# Altium schematic sheet OUT_RELE.SchDoc
size A4; SheetNumber: 4
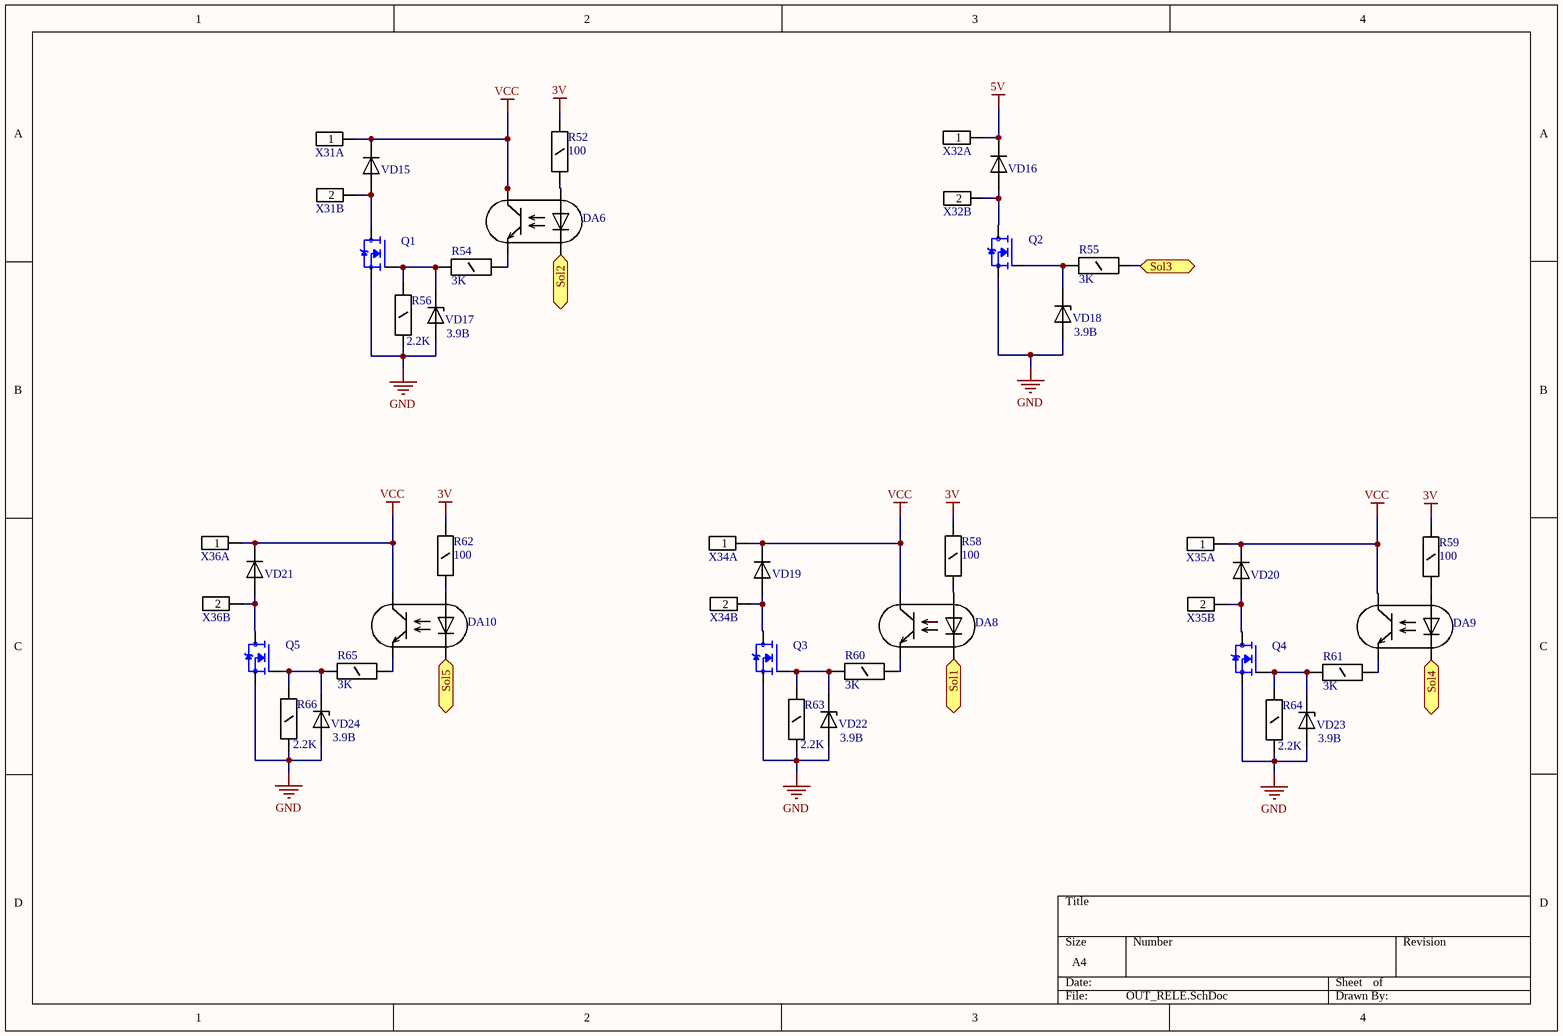
[diagram p0: OUT_RELE.SchDoc]

## Parts
DA6  PC817  [SOIC254P1000X400-4N]  (value not drawn)
DA8  PC817  [SOIC254P1000X400-4N]  (value not drawn)
DA9  PC817  [SOIC254P1000X400-4N]  (value not drawn)
DA10  PC817  [SOIC254P1000X400-4N]  (value not drawn)
Q1  IRFZ44N  [DPAK254P1524X483-3N]  (value not drawn)
Q2  IRFZ44N  [DPAK254P1524X483-3N]  (value not drawn)
Q3  IRFZ44N  [DPAK254P1524X483-3N]  (value not drawn)
Q4  IRFZ44N  [DPAK254P1524X483-3N]  (value not drawn)
Q5  IRFZ44N  [DPAK254P1524X483-3N]  (value not drawn)
R52  100  [R_1206]
R54  3K  [R_1206]
R55  3K  [R_1206]
R56  2.2K  [R_1206]
R58  100  [R_1206]
R59  100  [R_1206]
R60  3K  [R_1206]
R61  3K  [R_1206]
R62  100  [R_1206]
R63  2.2K  [R_1206]
R64  2.2K  [R_1206]
R65  3K  [R_1206]
R66  2.2K  [R_1206]
VD15  SMA4007  [SMA (DO-214AC)]  (value not drawn)
VD16  SMA4007  [SMA (DO-214AC)]  (value not drawn)
VD17  3.9В  [DL-35]
VD18  3.9В  [DL-35]
VD19  SMA4007  [SMA (DO-214AC)]  (value not drawn)
VD20  SMA4007  [SMA (DO-214AC)]  (value not drawn)
VD21  SMA4007  [SMA (DO-214AC)]  (value not drawn)
VD22  3.9В  [DL-35]
VD23  3.9В  [DL-35]
VD24  3.9В  [DL-35]
X31  DG508V-02  [DG508V-02]  (value not drawn)  (parts A,B of 2)
X32  DG508V-02  [DG508V-02]  (value not drawn)  (parts A,B of 2)
X34  DG508V-02  [DG508V-02]  (value not drawn)  (parts A,B of 2)
X35  DG508V-02  [DG508V-02]  (value not drawn)  (parts A,B of 2)
X36  DG508V-02  [DG508V-02]  (value not drawn)  (parts A,B of 2)

## Ports
Sol1, Sol2, Sol3, Sol4, Sol5

## Nets
3V: R52.1 R58.1 R59.1 R62.1
5V: VD16.K X32.1
GND: Q1.3(S) Q2.3(S) Q3.3(S) Q4.3(S) Q5.3(S) R56.1 R63.1 R64.1 R66.1 VD17.1 VD18.1 VD22.1 VD23.1 VD24.1
VCC: DA6.4 DA8.4 DA9.4 DA10.4 VD15.K VD19.K VD20.K VD21.K X31.1 X34.1 X35.1 X36.1
Sol1: DA8.2 ; port Sol1
Sol2: DA6.2 ; port Sol2
Sol3: R55.2 ; port Sol3
Sol4: DA9.2 ; port Sol4
Sol5: DA10.2 ; port Sol5
NetDA6_1: DA6.1 R52.2
NetDA6_3: DA6.3 R54.2
NetDA8_1: DA8.1 R58.2
NetDA8_3: DA8.3 R60.2
NetDA9_1: DA9.1 R59.2
NetDA9_3: DA9.3 R61.2
NetDA10_1: DA10.1 R62.2
NetDA10_3: DA10.3 R65.2
NetQ1_1: Q1.1(G) R54.1 R56.2 VD17.2
NetQ1_2: Q1.2(D) VD15.A X31.2
NetQ2_1: Q2.1(G) R55.1 VD18.2
NetQ2_2: Q2.2(D) VD16.A X32.2
NetQ3_1: Q3.1(G) R60.1 R63.2 VD22.2
NetQ3_2: Q3.2(D) VD19.A X34.2
NetQ4_1: Q4.1(G) R61.1 R64.2 VD23.2
NetQ4_2: Q4.2(D) VD20.A X35.2
NetQ5_1: Q5.1(G) R65.1 R66.2 VD24.2
NetQ5_2: Q5.2(D) VD21.A X36.2

## Library data of the parts
DA6 DA8-DA10 = KPC357NT: оптрон, SMD; Name: PC817; Mounting: SMD
Q1-Q5 = IRFZ44NSTRRPBF: N-Channel 55V 49A (Tc) 3.8W (Ta), 94W (Tc) Surface Mount D2PAK; MF: Infineon Technologies; Availability: Bad; Value: *; Check_prices: https://www.snapeda.com/parts/IRFZ44NSTRRPBF/Infineon%20Technologies/view-part/1356646/?ref=eda; Package: D2PAK Infineon; Price: None; MP: IRFZ44NSTRRPBF; SnapEDA_Link: https://www.snapeda.com/parts/IRFZ44NSTRRPBF/Infineon%20Technologies/view-part/1356646/?ref=snap
R52 R54-R56 R58-R66 = Резистор 1206: 0,25 Вт; Name: 1206; Power: 0.25 Вт; Tolerance: 5%; Voltage: 200В; Type: Резистор ЧИП; Mounting: SMD
  R52 R58 R59 R62: Value: 100
  R54 R55 R60 R61 R65: Value: 3K
  R56 R63 R64 R66: Value: 2.2K
VD15 VD16 VD19-VD21 = SMA400*: диод, SMD; Max current: 1 А; Drop voltage: 1.1 В; Name: SMA4007; Mounting: SMD; Temperature: -65 .. +175; Max voltage: ?
VD17 VD18 VD22-VD24 = BZV55C***: стабилитрон, SMD; Name: SMAJ30A-TR; Power: 0.5 Вт; Mounting: SMD; Voltage: 3.9В; Temperature range: -55 ... +175
X31 X32 X34-X36 = DG508V-02: клеммник винтовой 2к.,5.08мм; Analog: MKDS 2/3; Name: DG508V-02; Type: шаг 5,08 мм; Mounting: в отверстие